# Altium schematic sheet ASB.SchDoc (part 3 of 3)
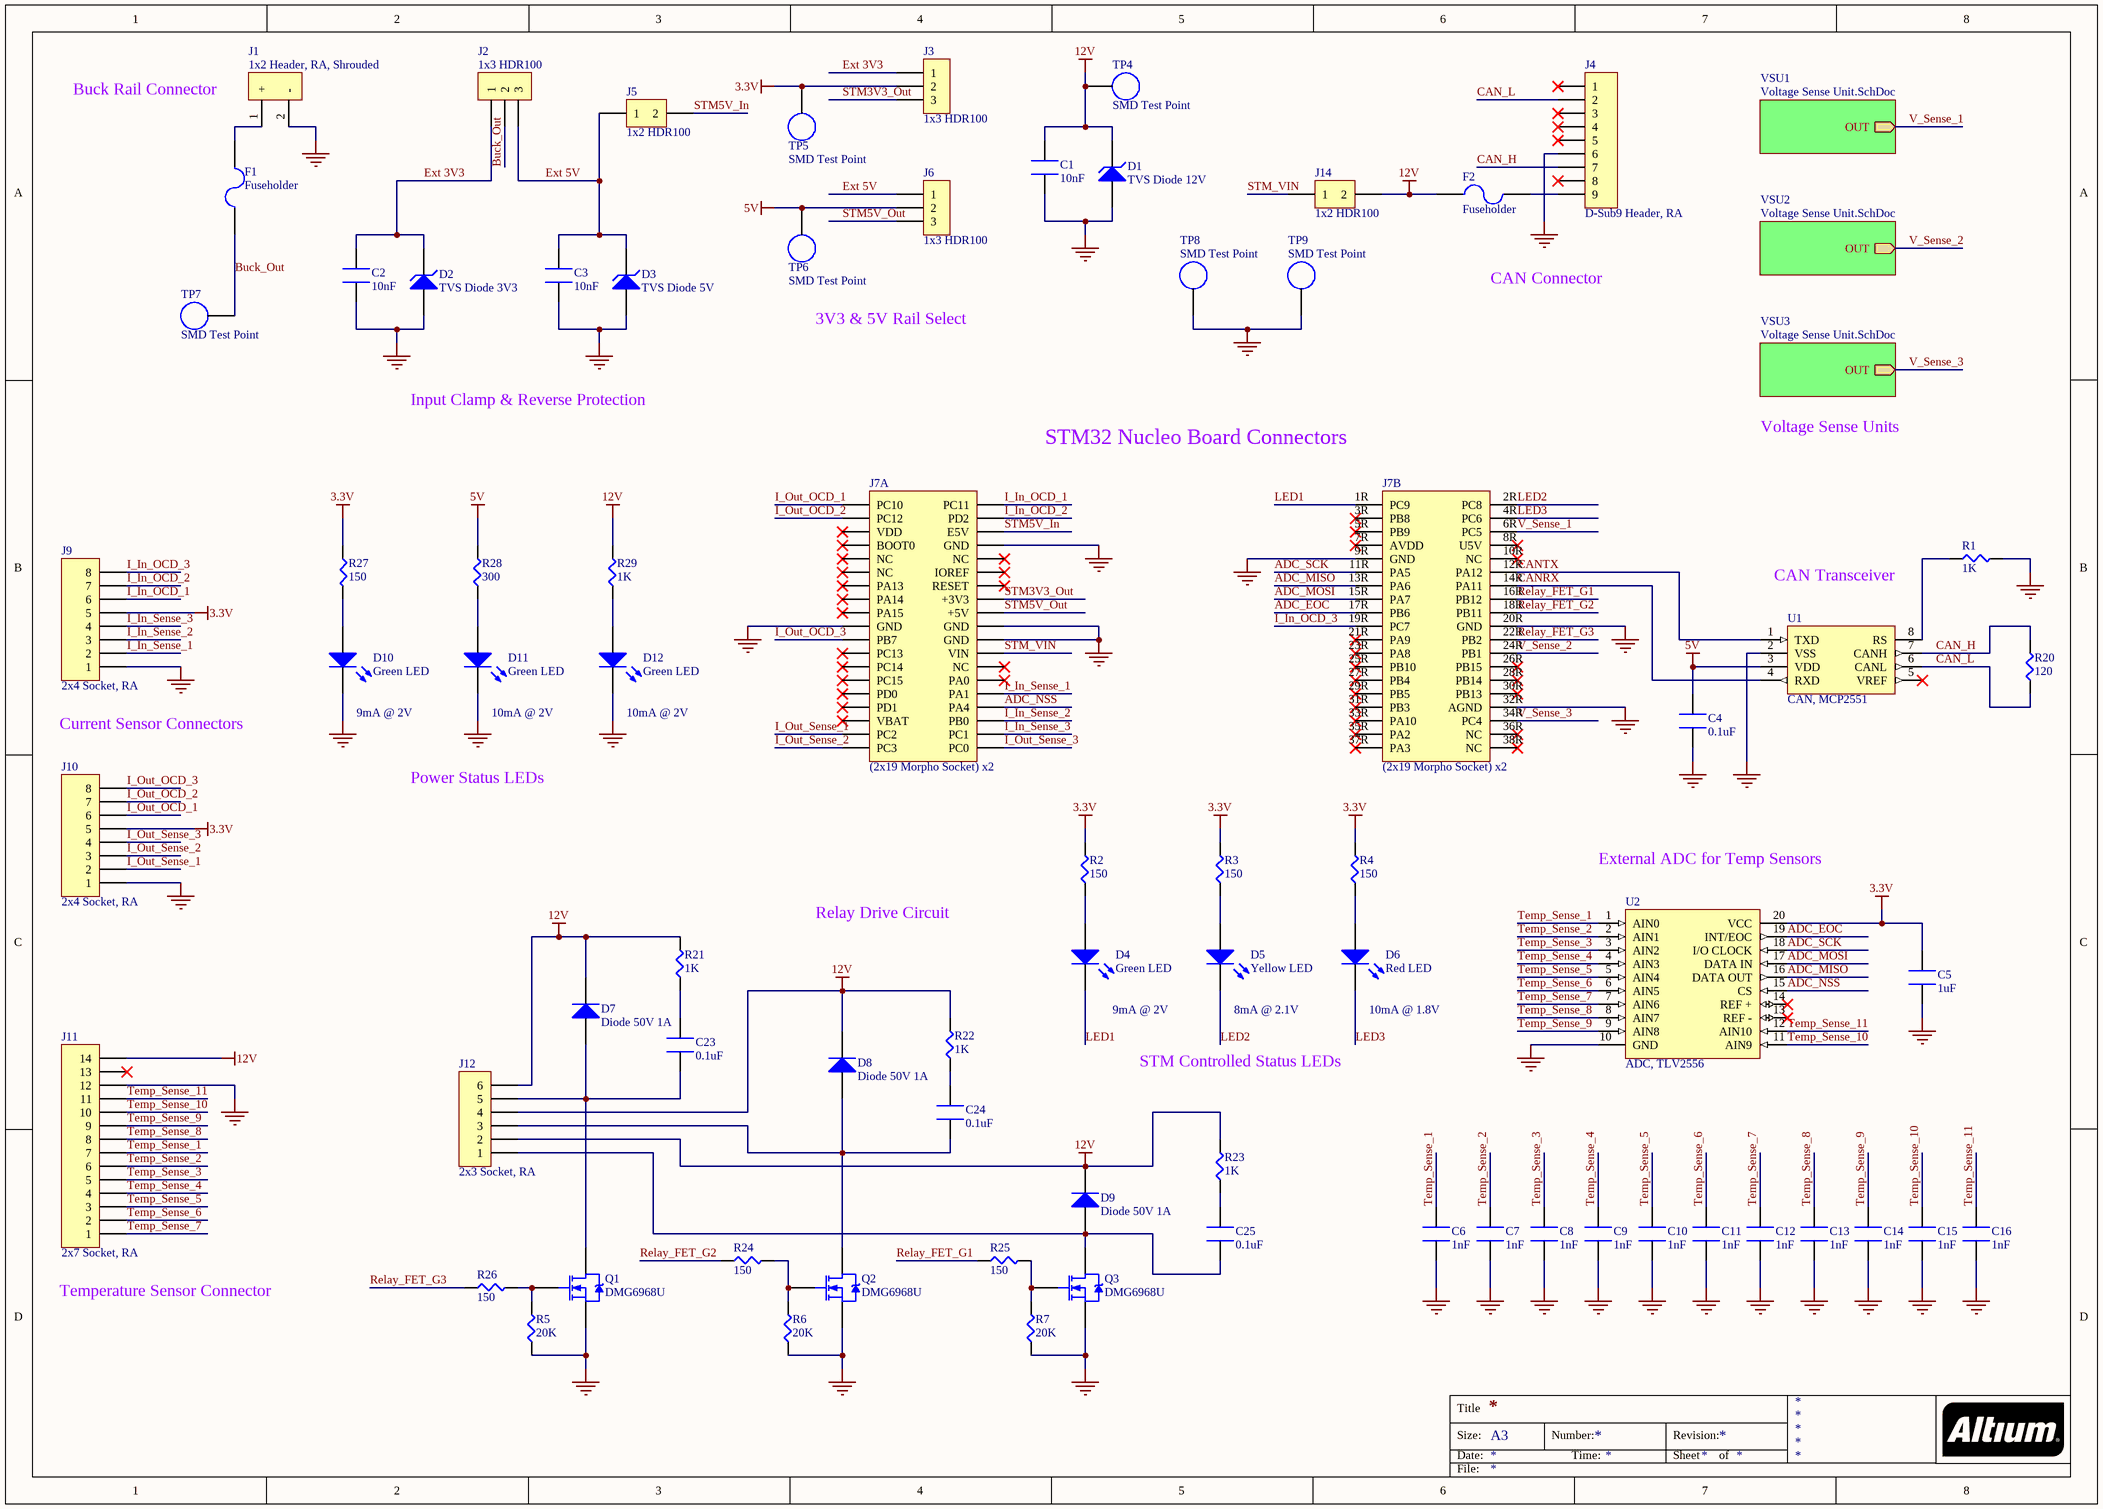
[diagram p2: ASB.SchDoc]

## Library data of the parts (continued)
R20 = ERJ6ENF1200V: RES SMD 120 OHM 1% 1/8W 0805; Manufacturer: Panasonic; Resistance: 120R; Power Rating: 125mW; Voltage Rating: 150V; Temperature Coefficient: 100ppm/°C; Supplier 1: Digi-Key; Supplier Part Number 1: P120CCT-ND; Manufacturer Part Number: ERJ6ENF1200V; Stock 1: 309479; Pricing 1: 1 = 0.10000, 10 = 0.08100, 100 = 0.03110, 1000 = 0.01367, 2500 = 0.01181 (USD); RoHS: Yes; Mount: Surface Mount; Case/Package: 0805; Number of Pins: 2; Case Code (Imperial): 0805; Case Code (Metric): 2012; Contact Plating: Tin; Min Operating Temperature: -55°C; Max Operating Temperature: 155°C; Tolerance: 1%; Packaging: Tape and Reel; Package Quantity: 1; Termination: SMD/SMT; Composition: Thick Film; Number of Terminations: 2; Military Standard: Not; Max Power Dissipation: 125mW; Voltage Rating (DC): 150V; Features: Automotive AEC-Q200; Length: 2mm; Height: 0.6mm; Width: 1.2mm; Depth: 1.25mm; Radiation Hardening: No; REACH SVHC: No SVHC; Lead Free: Lead Free; ComponentLink1URL: https://datasheet.ciiva.com/11821/0900766b80f80784-11821533.pdf?src-supplier=RSComponents; ComponentLink1Description: https://datasheet.ciiva.com/11821/0900766b80f80784-11821533.pdf?src-supplier=RSComponents; ComponentLink2URL: https://datasheet.ciiva.com/22673/1678782-22673701.pdf?src-supplier=Element14; ComponentLink2Description: https://datasheet.ciiva.com/22673/1678782-22673701.pdf?src-supplier=Element14; ComponentLink3URL: https://datasheet.ciiva.com/15158/getdatasheetpartid-248620-15158999.pdf?src-supplier=Verical; ComponentLink3Description: https://datasheet.ciiva.com/15158/getdatasheetpartid-248620-15158999.pdf?src-supplier=Verical; ComponentLink4URL: https://datasheet.ciiva.com/16782/70260748-16782215.pdf?src-supplier=Allied+Electronics; ComponentLink4Description: https://datasheet.ciiva.com/16782/70260748-16782215.pdf?src-supplier=Allied+Electronics; ComponentLink5URL: https://datasheet.ciiva.com/24069/aoa0000ce2-24069192.pdf?src-supplier=Mouser; ComponentLink5Description: https://datasheet.ciiva.com/24069/aoa0000ce2-24069192.pdf?src-supplier=Mouser; ComponentLink6URL: https://datasheet.ciiva.com/46373/1678782-46373272.pdf?src-supplier=Element14; ComponentLink6Description: https://datasheet.ciiva.com/46373/1678782-46373272.pdf?src-supplier=Element14; ComponentLink7URL: https://datasheet.ciiva.com/46373/1678782-46373273.pdf?src-supplier=Element14; ComponentLink7Description: https://datasheet.ciiva.com/46373/1678782-46373273.pdf?src-supplier=Element14; ComponentLink8URL: https://datasheet.ciiva.com/17207/aoa0000ce2-17207722.pdf?src-supplier=Avnet+Europe; ComponentLink8Description: https://datasheet.ciiva.com/17207/aoa0000ce2-17207722.pdf?src-supplier=Avnet+Europe; ComponentLink9URL: https://datasheet.ciiva.com/6082/426256-6082139.pdf?src-supplier=Farnell; ComponentLink9Description: https://datasheet.ciiva.com/6082/426256-6082139.pdf?src-supplier=Farnell; ComponentLink10URL: https://datasheet.ciiva.com/22687/1678782-22687419.pdf?src-supplier=Element14; ComponentLink10Description: https://datasheet.ciiva.com/22687/1678782-22687419.pdf?src-supplier=Element14; ComponentLink11URL: https://datasheet.ciiva.com/7886/426256-7886749.pdf?src-supplier=Element14; ComponentLink11Description: https://datasheet.ciiva.com/7886/426256-7886749.pdf?src-supplier=Element14; ComponentLink12URL: https://datasheet.ciiva.com/9117/aoa0000ce2-9117405.pdf?src-supplier=Avnet; ComponentLink12Description: https://datasheet.ciiva.com/9117/aoa0000ce2-9117405.pdf?src-supplier=Avnet; ComponentLink13URL: https://datasheet.ciiva.com/16765/70260748-16765246.pdf?src-supplier=Allied+Electronics; ComponentLink13Description: https://datasheet.ciiva.com/16765/70260748-16765246.pdf?src-supplier=Allied+Electronics; ComponentLink14URL: https://datasheet.ciiva.com/16514/aoa0000ce2-16514031.pdf?src-supplier=Avnet+Asia; ComponentLink14Description: https://datasheet.ciiva.com/16514/aoa0000ce2-16514031.pdf?src-supplier=Avnet+Asia; Category: Resistors
R28 = ERJ-6ENF3000V: RES SMD 300 OHM 1% 1/8W 0805; Manufacturer: Panasonic; Power Rating: 125mW; Voltage Rating: 150V; Resistance: 300R; Temperature Coefficient: 100ppm/°C; Supplier 1: Digi-Key; Supplier Part Number 1: P300CCT-ND; Manufacturer Part Number: ERJ-6ENF3000V; Stock 1: 271248; Pricing 1: 1 = 0.10000, 10 = 0.08100, 100 = 0.03110, 1000 = 0.01367, 2500 = 0.01181 (USD); RoHS: Yes; Mount: Surface Mount; Case/Package: 0805; Case Code (Imperial): 0805; Case Code (Metric): 2012; Contact Plating: Tin; Min Operating Temperature: -55°C; Max Operating Temperature: 155°C; Tolerance: 1%; Packaging: Tape and Reel; Package Quantity: 1; Composition: Thick Film; Number of Terminations: 2; Military Standard: Not; Max Power Dissipation: 125mW; Voltage Rating (DC): 150V; Features: Automotive AEC-Q200; Termination: SMD/SMT; Length: 2mm; Height: 0.028inch; Width: 1.2mm; Depth: 1.25mm; Radiation Hardening: No; REACH SVHC: No SVHC; Lead Free: Lead Free; ComponentLink1URL: https://datasheet.ciiva.com/7711/1678782-7711061.pdf?src-supplier=Element14; ComponentLink1Description: https://datasheet.ciiva.com/7711/1678782-7711061.pdf?src-supplier=Element14; ComponentLink2URL: https://datasheet.ciiva.com/9183/aoa0000ce2-9183350.pdf?src-supplier=Avnet; ComponentLink2Description: https://datasheet.ciiva.com/9183/aoa0000ce2-9183350.pdf?src-supplier=Avnet; ComponentLink3URL: https://datasheet.ciiva.com/30132/aoa0000ce2-30132023.pdf?src-supplier=Onlinecomponents.com; ComponentLink3Description: https://datasheet.ciiva.com/30132/aoa0000ce2-30132023.pdf?src-supplier=Onlinecomponents.com; ComponentLink4URL: https://datasheet.ciiva.com/17206/aoa0000ce2-17206376.pdf?src-supplier=Avnet+Europe; ComponentLink4Description: https://datasheet.ciiva.com/17206/aoa0000ce2-17206376.pdf?src-supplier=Avnet+Europe; ComponentLink5URL: https://datasheet.ciiva.com/16512/aoa0000ce2-16512233.pdf?src-supplier=Avnet+Asia; ComponentLink5Description: https://datasheet.ciiva.com/16512/aoa0000ce2-16512233.pdf?src-supplier=Avnet+Asia; ComponentLink6URL: https://datasheet.ciiva.com/22681/1678782-22681692.pdf?src-supplier=Element14; ComponentLink6Description: https://datasheet.ciiva.com/22681/1678782-22681692.pdf?src-supplier=Element14; ComponentLink7URL: https://datasheet.ciiva.com/46373/1678782-46373662.pdf?src-supplier=Element14; ComponentLink7Description: https://datasheet.ciiva.com/46373/1678782-46373662.pdf?src-supplier=Element14; ComponentLink8URL: https://datasheet.ciiva.com/46373/1678782-46373663.pdf?src-supplier=Element14; ComponentLink8Description: https://datasheet.ciiva.com/46373/1678782-46373663.pdf?src-supplier=Element14; Category: Resistors
TP4-TP9 = 5019: Phosphor Bronze Contact Miniature Silver Plated Surface Mount Test Points; Manufacturer: Keystone Electronics; Supplier 1: Digi-Key; Supplier Part Number 1: 36-5019CT-ND; Manufacturer Part Number: 5019; Stock 1: 396064; Pricing 1: 1 = 0.35000, 10 = 0.33100, 25 = 0.28400, 50 = 0.24120, 100 = 0.23180, 250 = 0.20812, 500 = 0.19866 (USD); RoHS: Yes; Mount: PCB,Surface Mount; Number of Pins: 1; Contact Plating: Silver; Material: Bronze; Contact Material: Bronze; Packaging: Tape and Reel; Package Quantity: 1; Termination: SMD/SMT; Height: 0.09inch; REACH SVHC: No SVHC; Lead Free: Lead Free; ComponentLink1URL: http://www.keyelco.com/userAssets/file/M60-2p61.pdf?src-supplier=Digi-Key; ComponentLink1Description: http://www.keyelco.com/userAssets/file/M60-2p61.pdf?src-supplier=Digi-Key; ComponentLink2URL: https://www.alliedelec.com/m/d/7cde97af424e5e26d7fd34350071af05.pdf?src-supplier=Allied+Electronics; ComponentLink2Description: https://www.alliedelec.com/m/d/7cde97af424e5e26d7fd34350071af05.pdf?src-supplier=Allied+Electronics; ComponentLink3URL: http://www.keyelco.com/userAssets/file/M60-2p61.pdf?src-supplier=Future+Electronics; ComponentLink3Description: http://www.keyelco.com/userAssets/file/M60-2p61.pdf?src-supplier=Future+Electronics; Category: Test and Measurement; ComponentLink4Description: Digikey; ComponentLink4URL: https://www.digikey.com/product-detail/en/keystone-electronics/5019/36-5019CT-ND/3907344
U1 = MCP2551-E/SN: IC, TRANSCEIVER, CAN, SMD, 8SOIC; Manufacturer: Microchip; Interface: CAN,Serial; Operating Supply Voltage: 5V; Data Rate: 1Mbps; Max Supply Voltage: 5.5V; Min Supply Voltage: 4.5V; Nominal Supply Current: 75mA; Number of Receive Buffers: 1; Supplier 1: Digi-Key; Supplier Part Number 1: MCP2551-E/SN-ND; Manufacturer Part Number: MCP2551-E/SN; Stock 1: 9215; Pricing 1: 1 = 1.22000, 25 = 1.00960, 100 = 0.91670 (USD); RoHS: Yes; Mount: Surface Mount; Case/Package: SOIC; Number of Pins: 8; Contact Plating: Matte,Tin; Min Operating Temperature: -40°C; Max Operating Temperature: 125°C; Package Quantity: 100; Packaging: Rail/Tube; Number of Transmit Buffers: 1; Max Supply Current: 75mA; Number of Transceivers: 1; Number of Drivers: 1; Number of Receivers: 1; Logic Function: Transceiver; Length: 0.192inch; Height: 0.059inch; Width: 0.154inch; Radiation Hardening: No; REACH SVHC: No SVHC; Lead Free: Lead Free; ComponentLink1URL: http://www.microchip.com/mymicrochip/filehandler.aspx?ddocname=en011797&src-supplier=Future+Electronics; ComponentLink1Description: http://www.microchip.com/mymicrochip/filehandler.aspx?ddocname=en011797&src-supplier=Future+Electronics; ComponentLink2URL: http://www.microchip.com/mymicrochip/filehandler.aspx?ddocname=en023833&src-supplier=Digi-Key; ComponentLink2Description: http://www.microchip.com/mymicrochip/filehandler.aspx?ddocname=en023833&src-supplier=Digi-Key; ComponentLink3URL: http://www.mouser.com/ds/2/268/20001667G-1115479.pdf?src-supplier=Mouser; ComponentLink3Description: http://www.mouser.com/ds/2/268/20001667G-1115479.pdf?src-supplier=Mouser; ComponentLink4URL: https://www.distrelec.biz/Web/Downloads/_t/ds/mcp2551_eng_tds.pdf?mime=application%2Fpdf&src-supplier=Distrelec; ComponentLink4Description: https://www.distrelec.biz/Web/Downloads/_t/ds/mcp2551_eng_tds.pdf?mime=application%2Fpdf&src-supplier=Distrelec; ComponentLink5URL: http://www.farnell.com/datasheets/2299423.pdf?src-supplier=Element14; ComponentLink5Description: http://www.farnell.com/datasheets/2299423.pdf?src-supplier=Element14; Category: Integrated Circuits (ICs); ComponentLink6Description: Digikey; ComponentLink6URL: https://www.digikey.ca/product-detail/en/microchip-technology/MCP2551-E-SN/MCP2551-E-SN-ND/509446
U2 = TLV2556IDW: IC SERIAL ADC 12-BIT 5V 20-SOIC; Manufacturer: Texas Instruments; Nominal Supply Current: 3mA; Min Supply Voltage: 2.7V; Max Supply Voltage: 5.5V; Number of Channels: 11; Max Power Dissipation: 2.43mW; Interface: SPI; Number of Bits: 12; Sampling Rate: 200KS/s; Number of Converters: 1; Resolution: 12b; Polarity: Unipolar; Differential Nonlinearity: 1LSB; Supply Type: Single; Supplier 1: Digi-Key; Supplier Part Number 1: 296-12502-5-ND; Manufacturer Part Number: TLV2556IDW; Stock 1: 5611; Pricing 1: 1 = 10.04000, 10 = 9.06900, 25 = 8.64680, 100 = 7.50800, 500 = 6.53790, 1000 = 5.69430 (USD); RoHS: Yes; Case/Package: SOIC; Number of Pins: 20; Min Operating Temperature: -40°C; Max Operating Temperature: 85°C; Package Quantity: 25; Packaging: Rail/Tube; Number of Elements: 1; Number of A/D Converters: 1; Number of Analog Inputs: 11; Conversion Rate: 200KS/s; Integral Nonlinearity (INL): 1LSB; Number of Inputs: 11; Max Supply Voltage (DC): 5.5V; Min Supply Voltage (DC): 2.7V; Power Consumption: 2.43mW; REACH SVHC: No SVHC; Lead Free: Lead Free; ComponentLink1URL: http://www.ti.com/lit/ds/symlink/tlv2556.pdf?src-supplier=Digi-Key; ComponentLink1Description: http://www.ti.com/lit/ds/symlink/tlv2556.pdf?src-supplier=Digi-Key; ComponentLink2URL: http://www.ti.com/general/docs/lit/getliterature.tsp?genericPartNumber=TLV2556&&fileType=pdf&src-supplier=Avnet; ComponentLink2Description: http://www.ti.com/general/docs/lit/getliterature.tsp?genericPartNumber=TLV2556&&fileType=pdf&src-supplier=Avnet; ComponentLink3URL: http://datasheet.iiic.cc/texas_instruments/TLV2556IDW.pdf?src-supplier=IIIC; ComponentLink3Description: http://datasheet.iiic.cc/texas_instruments/TLV2556IDW.pdf?src-supplier=IIIC; ComponentLink4URL: http://www.produktinfo.conrad.com/datenblaetter/1100000-1199999/001186451-da-01-en-IC_SERIAL_ADC_12__TLV2556IDW_SOIC_20_TID.pdf?src-supplier=Conrad; ComponentLink4Description: http://www.produktinfo.conrad.com/datenblaetter/1100000-1199999/001186451-da-01-en-IC_SERIAL_ADC_12__TLV2556IDW_SOIC_20_TID.pdf?src-supplier=Conrad; Category: Integrated Circuits (ICs)